# EAGLE design CleanIt (EAGLE 9.6.2)
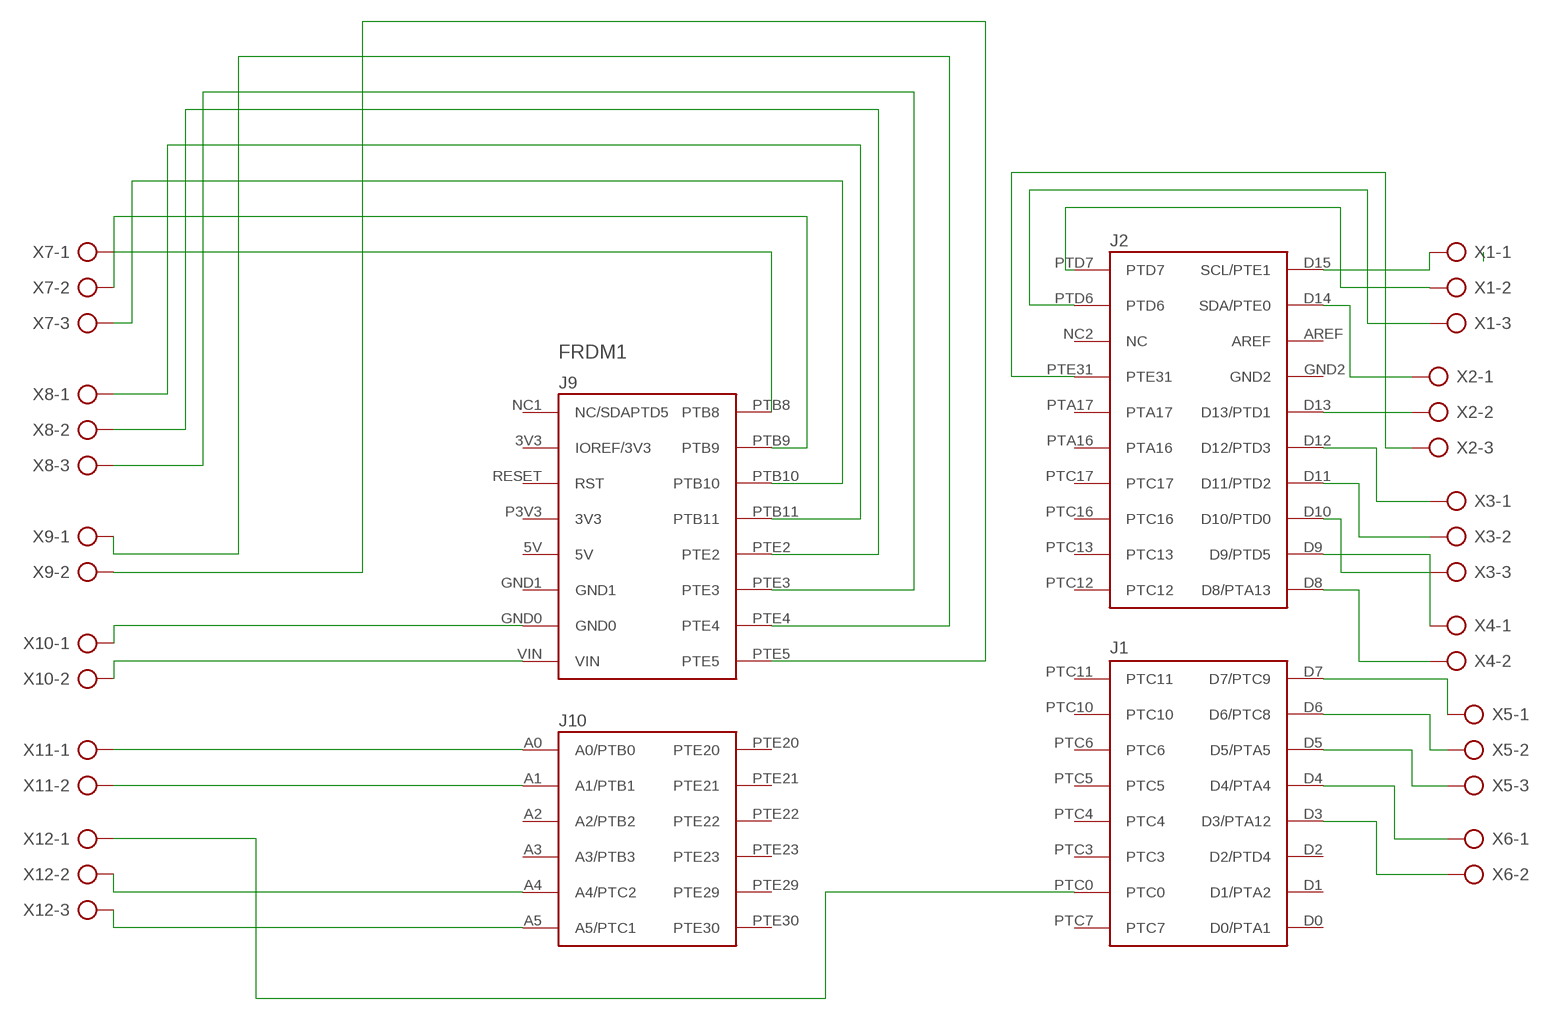
[diagram p0: schematic, sheet 1]

## Parts
FRDM1  FRDM-KL25ZNORMAL  [FRDM_KL25Z_NORMAL]
X1  AK500/3-H  [AK500/3-H]
X2  AK500/3-H  [AK500/3-H]
X3  AK500/3-H  [AK500/3-H]
X4  AK500/2-H  [AK500/2-H]
X5  AK500/3-H  [AK500/3-H]
X6  AK500/2-H  [AK500/2-H]
X7  AK500/3-H  [AK500/3-H]
X8  AK500/3-H  [AK500/3-H]
X9  AK500/2-H  [AK500/2-H]
X10  AK500/2-H  [AK500/2-H]
X11  AK500/2-H  [AK500/2-H]
X12  AK500/3-H  [AK500/3-H]

## Nets
N$1: FRDM1.D15(SCL/PTE1) X1.1
N$2: FRDM1.PTD7 X1.2
N$3: FRDM1.PTD6 X1.3
N$4: FRDM1.D14(SDA/PTE0) X2.1
N$5: FRDM1.D13(D13/PTD1) X2.2
N$6: FRDM1.PTE31 X2.3
N$8: FRDM1.D12(D12/PTD3) X3.1
N$9: FRDM1.D11(D11/PTD2) X3.2
N$10: FRDM1.D10(D10/PTD0) X3.3
N$11: FRDM1.D9(D9/PTD5) X4.1
N$12: FRDM1.D8(D8/PTA13) X4.2
N$13: FRDM1.D7(D7/PTC9) X5.1
N$14: FRDM1.D6(D6/PTC8) X5.2
N$15: FRDM1.D5(D5/PTA5) X5.3
N$16: FRDM1.D4(D4/PTA4) X6.1
N$17: FRDM1.D3(D3/PTA12) X6.2
N$18: FRDM1.PTB8 X7.1
N$19: FRDM1.PTB9 X7.2
N$20: FRDM1.PTB10 X7.3
N$21: FRDM1.PTB11 X8.1
N$22: FRDM1.PTE2 X8.2
N$23: FRDM1.PTE3 X8.3
N$24: FRDM1.PTE4 X9.1
N$25: FRDM1.PTE5 X9.2
N$26: FRDM1.GND0 X10.1
N$27: FRDM1.VIN X10.2
N$28: FRDM1.A0(A0/PTB0) X11.1
N$29: FRDM1.A1(A1/PTB1) X11.2
N$30: FRDM1.PTC0 X12.1
N$31: FRDM1.A4(A4/PTC2) X12.2
N$32: FRDM1.A5(A5/PTC1) X12.3
Unconnected: FRDM1.3V3(IOREF/3V3) FRDM1.5V FRDM1.A2(A2/PTB2) FRDM1.A3(A3/PTB3) FRDM1.AREF FRDM1.D0(D0/PTA1) FRDM1.D1(D1/PTA2) FRDM1.D2(D2/PTD4) FRDM1.GND1 FRDM1.GND2 FRDM1.NC1(NC/SDAPTD5) FRDM1.NC2(NC) FRDM1.P3V3(3V3) FRDM1.PTA16 FRDM1.PTA17 FRDM1.PTC3 FRDM1.PTC4 FRDM1.PTC5 FRDM1.PTC6 FRDM1.PTC7 FRDM1.PTC10 FRDM1.PTC11 FRDM1.PTC12 FRDM1.PTC13 FRDM1.PTC16 FRDM1.PTC17 FRDM1.PTE20 FRDM1.PTE21 FRDM1.PTE22 FRDM1.PTE23 FRDM1.PTE29 FRDM1.PTE30 FRDM1.RESET(RST)

## Library data of the parts
FRDM1 = FRDM-KL25Z:FRDM-KL25Z: For creating FRDM-KL25Z shields Check availability <https://pricing.snapeda.com/parts/FRDM-KL25Z/NXP%20USA/view-part?ref=eda>; AVAILABILITY: In Stock; DESCRIPTION: KL1x, KL2x, mbed-Enabled Development Freedom Kinetis ARM® Cortex®-M0+ MCU 32-Bit Embedded Evaluation Board; MF: NXP USA; MP: FRDM-KL25Z; PACKAGE: None; PRICE: None; PURCHASE-URL: https://pricing.snapeda.com/search/part/FRDM-KL25Z/?ref=eda
X1-X3 X5 X7 X8 X12 = con-ptr500:AK500/3-H: CONNECTOR Aug. 2004 / PTR Meßtechnik: Die Bezeichnung der Serie AK505 wurde geändert. Es handelt sich hierbei um AK500 in horizontaler Ausführung.; OC_FARNELL: unknown; OC_NEWARK: unknown
X4 X6 X9-X11 = con-ptr500:AK500/2-H: CONNECTOR Aug. 2004 / PTR Meßtechnik: Die Bezeichnung der Serie AK505 wurde geändert. Es handelt sich hierbei um AK500 in horizontaler Ausführung.; OC_FARNELL: unknown; OC_NEWARK: unknown

## Board
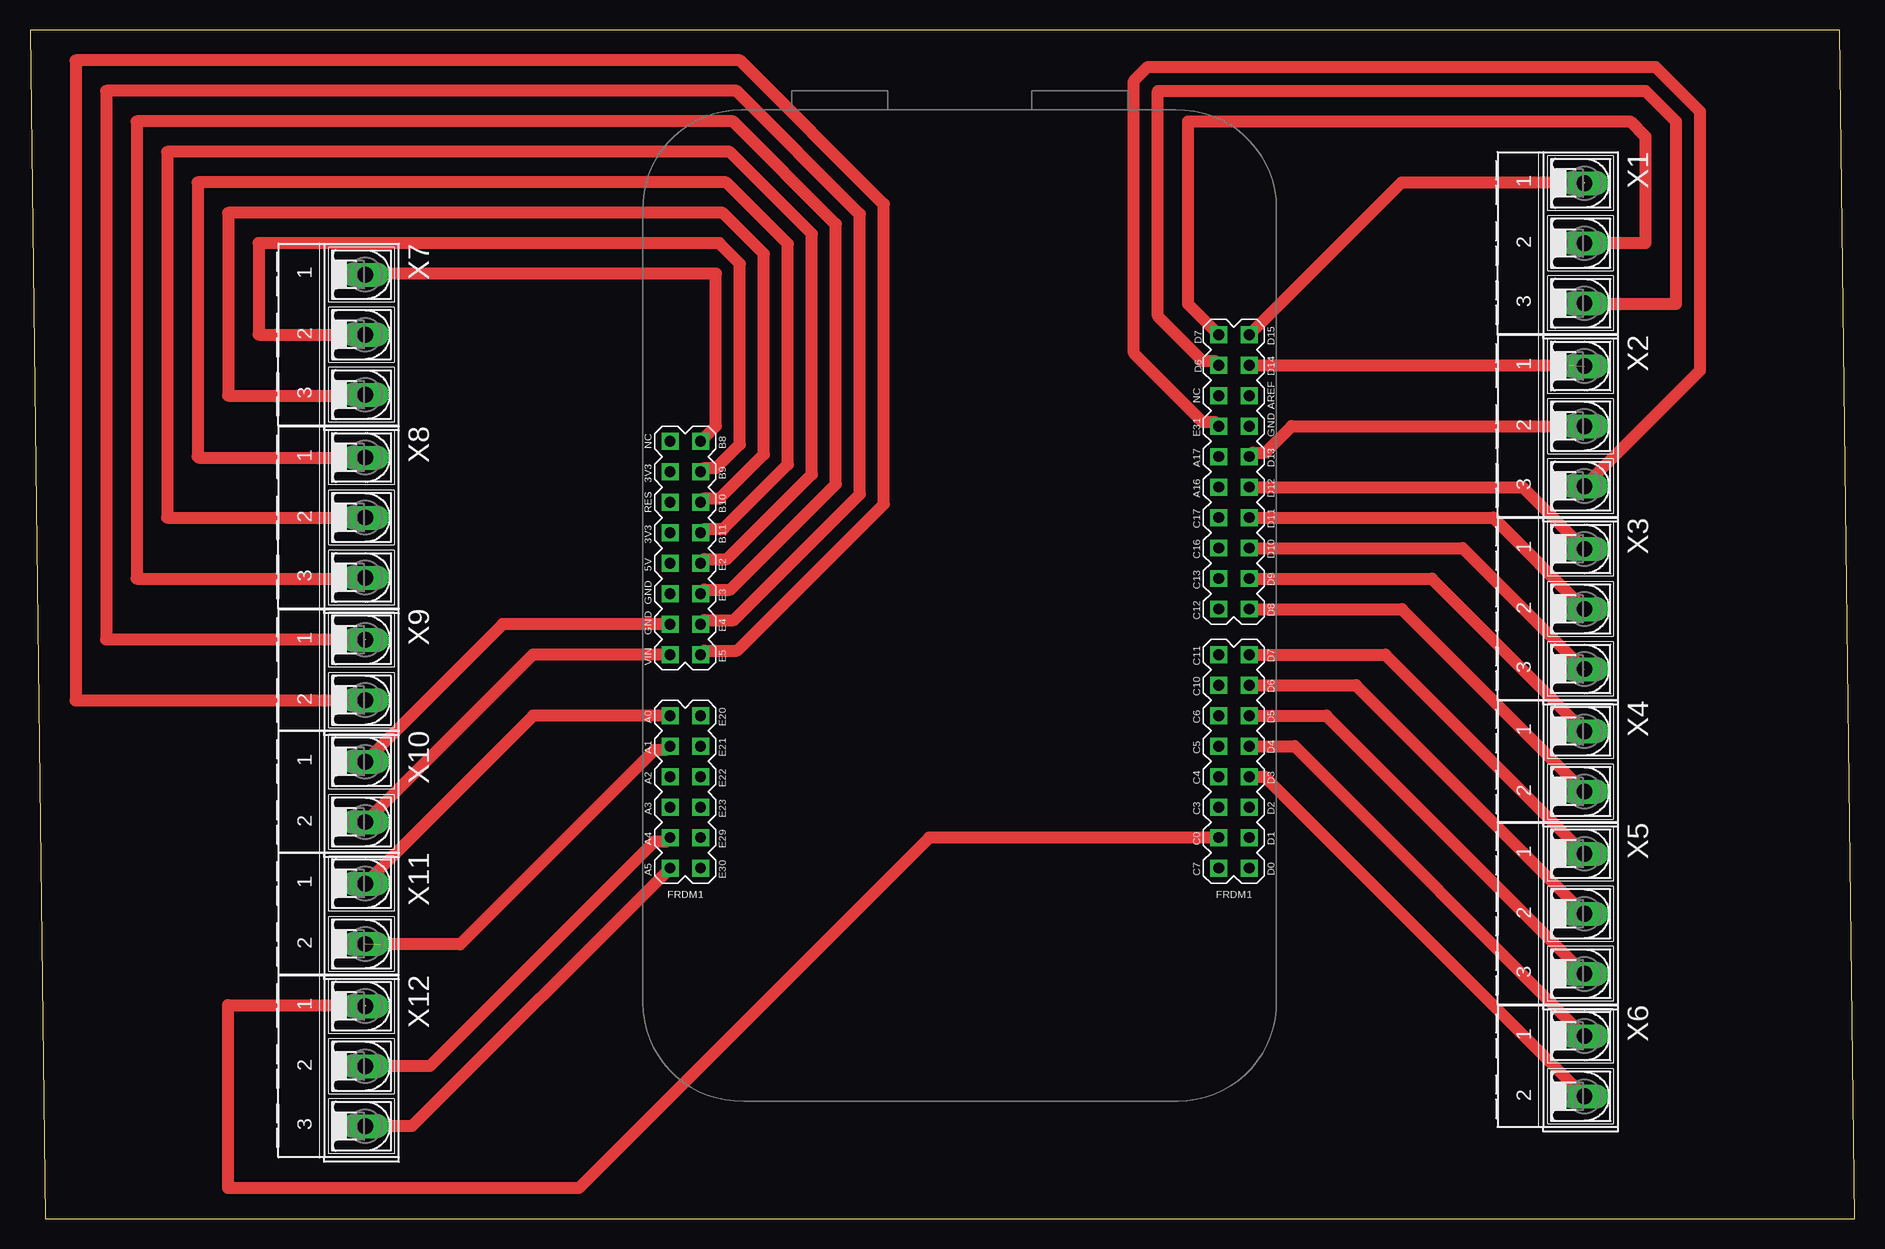
[diagram p1: board, top side]

Size 152.07 x 99.05 mm. Coordinates in mm from the lower left corner, seen from the top.
Outline: 1.27,0 152.07,0 150.8,99.05 0,99.05 1.27,0
Copper layers (1*16): Top 0.035mm / dielectric 1.5mm / Bottom 0.035mm
Design rules "default *": minimum track width 1mm, minimum drill 0.35mm, track to track 1mm, track to pad 1mm, pad to pad 6mil, via to via 6mil, smd to smd 6mil, copper to edge 40mil, drill to drill 6mil, minimum pad ring 10mil, minimum via ring 8mil, stop-mask expansion 4mil, vias tented up to drill 0mil, thermal gap 10mil

### Footprints (pad centres in the part's own frame; a part is rotated, then mirrored left to right if it is on the bottom)
FRDM_KL25Z_NORMAL = drill 0.9 square: 3V3 24.13,-15.24; 5V 24.13,-7.62; A0 24.13,5.08; A1 24.13,7.62; A2 24.13,10.16; A3 24.13,12.7; A4 24.13,15.24; A5 24.13,17.78; AREF -24.13,-21.59; D0 -24.13,17.78; D1 -24.13,15.24; D2 -24.13,12.7; D3 -24.13,10.16; D4 -24.13,7.62; D5 -24.13,5.08; D6 -24.13,2.54; D7 -24.13,0; D8 -24.13,-3.81; D9 -24.13,-6.35; D10 -24.13,-8.89; D11 -24.13,-11.43; D12 -24.13,-13.97; D13 -24.13,-16.51; D14 -24.13,-24.13; D15 -24.13,-26.67; GND0 24.13,-2.54; GND1 24.13,-5.08; GND2 -24.13,-19.05; NC1 24.13,-17.78; NC2 -21.59,-21.59; P3V3 24.13,-10.16; PTA16 -21.59,-13.97; PTA17 -21.59,-16.51; PTB8 21.59,-17.78; PTB9 21.59,-15.24; PTB10 21.59,-12.7; PTB11 21.59,-10.16; PTC0 -21.59,15.24; PTC3 -21.59,12.7; PTC4 -21.59,10.16; PTC5 -21.59,7.62; PTC6 -21.59,5.08; PTC7 -21.59,17.78; PTC10 -21.59,2.54; PTC11 -21.59,0; PTC12 -21.59,-3.81; PTC13 -21.59,-6.35; PTC16 -21.59,-8.89; PTC17 -21.59,-11.43; PTD6 -21.59,-24.13; PTD7 -21.59,-26.67; PTE2 21.59,-7.62; PTE3 21.59,-5.08; PTE4 21.59,-2.54; PTE5 21.59,0; PTE20 21.59,5.08; PTE21 21.59,7.62; PTE22 21.59,10.16; PTE23 21.59,12.7; PTE29 21.59,15.24; PTE30 21.59,17.78; PTE31 -21.59,-19.05; RESET 24.13,-12.7; VIN 24.13,0
AK500/3-H = drill 1.321 long: 1 -5.004,0; 2 0,0; 3 5.004,0
AK500/2-H = drill 1.321 long: 1 -2.515,0; 2 2.515,0

### Placement (x,y rotation side)
FRDM1  77.47,46.99 180 top
X1  129.54,81.28 270 top
X2  129.54,66.04 270 top
X3  129.54,50.8 270 top
X4  129.54,38.1 270 top
X5  129.54,25.4 270 top
X6  129.54,12.7 270 top
X7  27.94,73.66 270 top
X8  27.94,58.42 270 top
X9  27.94,45.72 270 top
X10  27.94,35.56 270 top
X11  27.94,25.4 270 top
X12  27.94,12.7 270 top

### Tracks (layer width: path | path; a pad name or v marks a point on that pad's centre or on a via)
N$1  (1 unrouted)
  Top 1: FRDM1.D15 114.3,86.36 129.54,86.36
N$2
  Top 1: FRDM1.PTD7 96.52,76.2 96.52,91.44 133.35,91.44 134.62,90.17 134.62,81.28 X1.2
N$3
  Top 1: FRDM1.PTD6 98.72,71.46 97.73,71.46 93.98,75.21 93.98,93.98 134.62,93.98 137.16,91.44 137.16,76.2 129.62,76.2 X1.3
N$4  (1 unrouted)
  Top 1: FRDM1.D14 128.27,71.12
N$5
  Top 1: FRDM1.D13 101.94,63.84 102.92,63.84 105.13,66.04 X2.2
N$6
  Top 1: FRDM1.PTE31 98.72,66.38 97.73,66.38 91.98,72.13 91.98,94.81 93.15,95.98 135.45,95.98 139.16,92.27 139.16,70.66 X2.3
N$8
  Top 1: FRDM1.D12 124.38,60.96 X3.1
N$9
  Top 1: FRDM1.D11 121.92,58.42 X3.2
N$10  (1 unrouted)
  Top 1: FRDM1.D10 119.38,55.88 129.54,45.72
N$11
  Top 1: FRDM1.D9 116.81,53.34 X4.1
N$12
  Top 1: FRDM1.D8 114.33,50.8 X4.2
N$13
  Top 1: FRDM1.D7 112.95,46.99 X5.1
N$14
  Top 1: FRDM1.D6 110.49,44.45 X5.2
N$15
  Top 1: FRDM1.D5 108.03,41.91 X5.3
N$16
  Top 1: FRDM1.D4 105.38,39.37 X6.1
N$17
  Top 1: FRDM1.D3 102.89,36.83 X6.2
N$18
  Top 1: FRDM1.PTB8 57.15,66.04 57.15,78.74 28.02,78.74 X7.1
N$19
  Top 1: FRDM1.PTB9 56.22,62.57 57.21,62.57 59.15,64.51 59.15,79.57 57.44,81.28 19.05,81.28 19.05,73.66 X7.2
N$20
  Top 1: FRDM1.PTB10 56.22,60.03 57.49,60.03 61.15,63.68 61.15,80.4 57.73,83.82 16.51,83.82 16.51,68.58 27.86,68.58 X7.3
N$21
  Top 1: FRDM1.PTB11 56.22,57.49 57.78,57.49 63.15,62.85 63.15,81.22 58.02,86.36 13.97,86.36 13.97,63.5 14.05,63.42 X8.1
N$22
  Top 1: FRDM1.PTE2 56.22,54.95 58.07,54.95 65.15,62.02 65.15,82.05 58.3,88.9 11.43,88.9 11.43,58.42 X8.2
N$23
  Top 1: FRDM1.PTE3 56.22,52.41 58.36,52.41 67.15,61.2 67.15,82.88 58.59,91.44 8.89,91.44 8.89,53.34 27.86,53.34 X8.3
N$24  (1 unrouted)
  Top 1: FRDM1.PTE4 56.22,49.87 58.65,49.87 69.15,60.37 69.15,83.71 58.88,93.98 6.35,93.98 6.35,48.26 27.94,48.26
N$25  (1 unrouted)
  Top 1: FRDM1.PTE5 56.22,47.33 58.94,47.33 71.15,59.54 71.15,84.54 59.17,96.52 3.81,96.52 3.81,43.18 27.94,43.18
N$26
  Top 1: FRDM1.GND0 39.4,49.53 X10.1
N$27  (1 unrouted)
  Top 1: FRDM1.VIN 41.91,46.99 27.94,33.02
N$28
  Top 1: FRDM1.A0 41.94,41.91 X11.1
N$29  (1 unrouted)
  Top 1: FRDM1.A1 53,39.03 52.02,39.03 35.84,22.86 29.21,22.86
N$30  (1 unrouted)
  Top 1: 27.94,17.78 16.51,17.78 16.51,2.54 45.72,2.54 74.93,31.75 FRDM1.PTC0
N$31
  Top 1: FRDM1.A4 53,31.41 52.02,31.41 33.3,12.7 X12.2
N$32
  Top 1: FRDM1.A5 31.83,7.7 X12.3